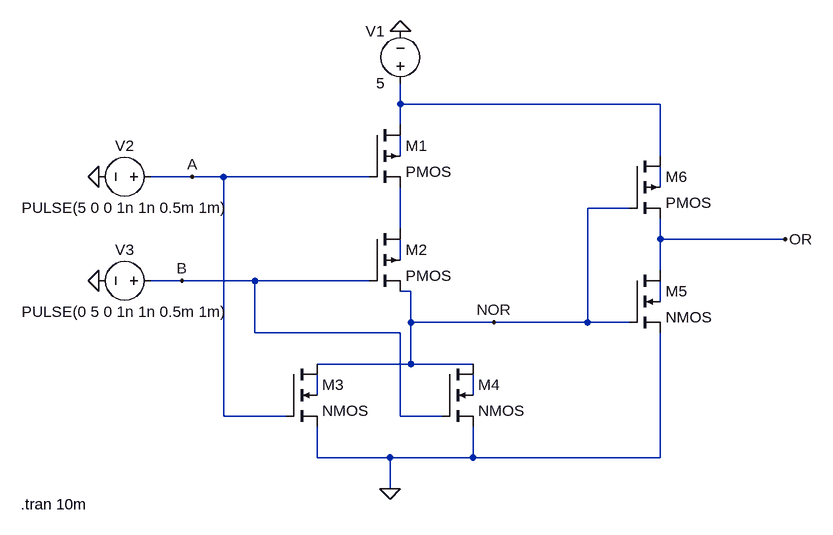
[diagram p0: schematic OR_NOR.asc]
OR_NOR.asc, the LTspice schematic file:
Version 4
SHEET 1 880 680
WIRE 112 32 112 0
WIRE 512 32 112 32
WIRE 112 64 112 32
WIRE 112 112 112 80
WIRE 512 112 512 32
WIRE -208 144 -272 144
WIRE -160 144 -208 144
WIRE 64 144 -160 144
WIRE 512 160 512 128
WIRE 464 192 400 192
WIRE 112 224 112 160
WIRE 512 240 512 208
WIRE 704 240 512 240
WIRE 112 272 112 240
WIRE 512 288 512 240
WIRE -224 304 -272 304
WIRE -112 304 -224 304
WIRE 64 304 -112 304
WIRE 128 320 112 320
WIRE 512 336 512 304
WIRE 128 368 128 320
WIRE 256 368 128 368
WIRE 400 368 400 192
WIRE 400 368 256 368
WIRE 464 368 400 368
WIRE -112 384 -112 304
WIRE 112 384 -112 384
WIRE 128 432 128 368
WIRE 128 432 -16 432
WIRE 224 432 128 432
WIRE -16 480 -16 448
WIRE 224 480 224 448
WIRE -160 512 -160 144
WIRE -64 512 -160 512
WIRE 112 512 112 384
WIRE 176 512 112 512
WIRE -16 576 -16 528
WIRE 96 576 -16 576
WIRE 224 576 224 528
WIRE 224 576 96 576
WIRE 512 576 512 384
WIRE 512 576 224 576
WIRE 96 624 96 576
FLAG 112 -80 0
FLAG 96 624 0
FLAG 704 240 OR
FLAG 256 368 NOR
FLAG -352 144 0
FLAG -352 304 0
FLAG -208 144 A
FLAG -224 304 B
SYMBOL pmos4 64 64 R0
SYMATTR InstName M1
SYMBOL pmos4 64 224 R0
SYMATTR InstName M2
SYMBOL nmos4 -64 432 R0
SYMATTR InstName M3
SYMBOL nmos4 176 432 R0
SYMATTR InstName M4
SYMBOL nmos4 464 288 R0
SYMATTR InstName M5
SYMBOL pmos4 464 112 R0
SYMATTR InstName M6
SYMBOL voltage 112 16 R180
WINDOW 0 24 96 Left 2
WINDOW 3 24 16 Left 2
WINDOW 123 0 0 Left 0
WINDOW 39 0 0 Left 0
SYMATTR InstName V1
SYMATTR Value 5
SYMBOL voltage -256 144 R90
WINDOW 0 -32 56 VBottom 2
WINDOW 3 32 56 VTop 2
WINDOW 123 0 0 Left 0
WINDOW 39 0 0 Left 0
SYMATTR InstName V2
SYMATTR Value PULSE(5 0 0 1n 1n 0.5m 1m)
SYMBOL voltage -256 304 R90
WINDOW 0 -32 56 VBottom 2
WINDOW 3 32 56 VTop 2
WINDOW 123 0 0 Left 0
WINDOW 39 0 0 Left 0
SYMATTR InstName V3
SYMATTR Value PULSE(0 5 0 1n 1n 0.5m 1m)
TEXT -472 648 Left 2 !.tran 10m

The netlist it stands for:
* OR_NOR.asc
M1 N001 A N004 N002 PMOS
M2 N004 B NOR N005 PMOS
M3 NOR A 0 N007 NMOS
M4 NOR B 0 N008 NMOS
M5 OR NOR 0 N006 NMOS
M6 N001 NOR OR N003 PMOS
V1 N001 0 5
V2 A 0 PULSE(5 0 0 1n 1n 0.5m 1m)
V3 B 0 PULSE(0 5 0 1n 1n 0.5m 1m)
.model NMOS NMOS
.model PMOS PMOS
.lib standard.mos
.tran 10m
.backanno
.end